# Altium schematic sheet Measuring.SchDoc: Measuring
size A4; ApprovedBy: Ekrem Turan Fırat; CheckedBy: Ekrem Turan Fırat; Author: Ekrem Turan Fırat; CompanyName: Mergen Elektronik; DrawnBy: Ekrem T. Fırat; Engineer: Ekrem Turan Fırat; Organization: Mergen Elektronik; Address1: Türkiye; DocumentNumber: 20240101; Revision: v0.0.1; SheetNumber: 6; SheetTotal: 7
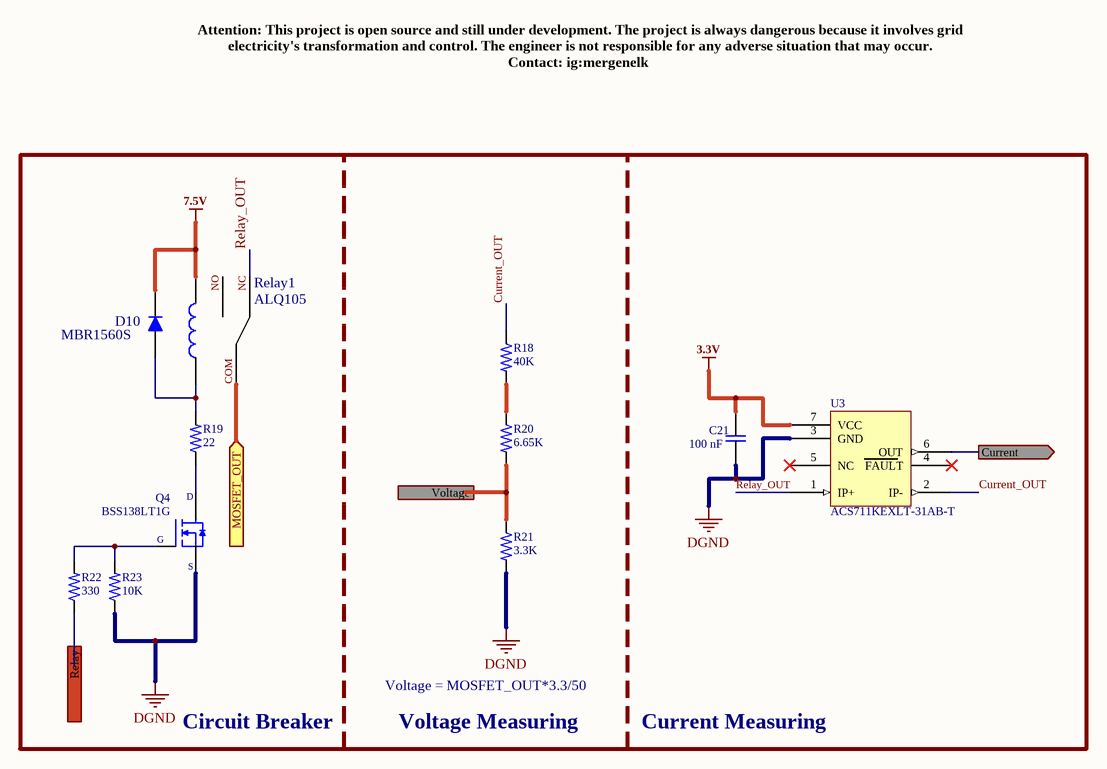
[diagram p0: Measuring.SchDoc]

## Parts
C21  100 nF  [MergenElektronik_Capacitors_Ceramics_SMDs_0603_S_NS]
D10  MBR1560S  [MergenElektronik_Diodes_SingleDiodes_TO-277B]
Q4  BSS138LT1G  [MergenElektronik_Transistors_Mosfets_SOT-23]
R18  40K  [MergenElektronik_Resistors_ChipResistors_0603_S_NS]
R19  22  [MergenElektronik_Resistors_ChipResistors_0603_S]
R20  6.65K  [MergenElektronik_Resistors_ChipResistors_0603_S_NS]
R21  3.3K  [MergenElektronik_Resistors_ChipResistors_0603_S_NS]
R22  330  [MergenElektronik_Resistors_ChipResistors_0603_S_NS]
R23  10K  [MergenElektronik_Resistors_ChipResistors_0603_S_NS]
Relay1  ALQ105  [MergenElektronik_Relays_PowerRelays_ALQ105]
U3  ACS711KEXLT-31AB-T  [MergenElektronik_Sensors_CurrentSensors_ACS711KEXLT-31AB-T]

## Ports
Current (out, see MicroController[3B]), MOSFET_OUT (in, see GateDriverandMosfets[3A], GateDriverandMosfets[3B], GateDriverandMosfets[3C]), Relay (in, see MicroController[3B]), Voltage (out, see MicroController[3B])

## Nets
3.3V: C21.1 U3.7(VCC)
7.5V: D10.2(KATOT) Relay1.C2
DGND: C21.2 Q4.2(Source) R21.2 R23.1 U3.3(GND)
Current: U3.6(OUT) ; port Current
Current_OUT: R18.1 U3.2(IP-)
MOSFET_OUT: Relay1.COM ; port MOSFET_OUT
Relay: R22.1 ; port Relay
Relay_OUT: Relay1.NC U3.1(IP+)
Voltage: R20.2 R21.1 ; port Voltage
NetD10_1: D10.1(ANOT) R19.2 Relay1.C1
NetQ4_1: Q4.1(Gate) R22.2 R23.2
NetQ4_3: Q4.3(Drain) R19.1
NetR18_2: R18.2 R20.1

Not connected (* = marked no-connect by the designer): Relay1 NO; U3 4(FAULT)* 5(NC)*

## Notes on the sheet
- Attention: This project is open source and still under development. The project is always dangerous because it involves grid electricity's transformation and control. The engineer is not responsible for any adverse situation that may occur.
  Contact: ig:mergenelk
- Circuit Breaker
- Voltage = MOSFET_OUT*3.3/50
- Voltage Measuring
- Current Measuring
- Title:
- Size:
- Date:
- A4
- Number:
- Time:
- Revision:
- Sheet
- of
- Project
- Drawn By :
- (in symbol MergenElektronik_Transistors_Mosfets_BSS138LT1G) D; G; S

## Library data of the parts
C21 = MergenElektronik_Capacitors_Ceramic_SMDs_100nF_16V: Mergen Elektronik - Capacitors - Ceramics - SMDs - 0603 - 100 nF - 16V; Manufacturer: Samsung; Manufacturer Number: CL10B104KO8NNNC; Model: Ceramic Capacitors; Tolerance: ±10%; Value: 100 nF; Temperature: -55°C up to +125°C; Digi-Key Number: 1276-1005-1-ND; Package: 0603(1608); Mouser Number: 187-CL10B104KO8NNNC; Mounting Type: Surface Mount; Farnell Number: 3013413; Supplier 1: Mouser; Supplier 2: Digi-Key; Supplier Part Number 1: 187-CL10B104KO8NNNC; Supplier Part Number 2: 1276-1005-6-ND; Özdisan Number: CL10B104KO8NNNC; Voltage Rated: 16V
D10 = MergenElektronik_Diodes_SingleDiodes_MBR1560S: Mergen Elektronik - Diodes - Single Diodes - MBR1560S; Manufacturer: SMC Diode Solutions; Voltage Rated: 60V; Current Rating: 15A; Digi-Key Number: 1655-MBR1560SCT-ND; Manufacturer Number: MBR1560S; Model: Single Diodes; Mounting Type: Surface Mount; Package: TO-277B; Temperature: -55°C up to +150°C; Supplier 1: Digi-Key; Supplier Part Number 1: 1655-MBR1560SCT-ND
Q4 = MergenElektronik_Transistors_Mosfets_BSS138LT1G: Mergen Elektronik - Transistors - Mosfets - BSS138LT1G; Manufacturer: onsemi; Voltage Rated: 50V; Model: Mosfet; Id: 200mA; Value: BSS138LT1G; Temperature: -55°C up to +175°C (TJ); Digi-Key Number: BSS138LT1GOSCT-ND; Manufacturer Number: BSS138LT1G; Package: SOT-23; Mounting Type: Surface Mount; Vdss: 50V; Rating Current: 200mA; Mouser Number: 863-BSS138LT1G; Farnell Number: 1431319; Supplier 1: Digi-Key; Supplier 2: Mouser; Supplier Part Number 1: BSS138LT1GOSCT-ND; Supplier Part Number 2: 863-BSS138LT1G; Özdisan Number: BSS138LT1G; Current Rating: 200mA
R18 = MergenElektronik_Resistors_ChipResistors_0603_40K: Mergen Elektronik - Resistors - Chip Resistors - 0603 - 40K; Manufacturer: YAGEO; Manufacturer Number: RT0603BRD0740KL; Value: Chip Resistor - 0603 - 40K; Power: 1/10W; Tolerance: ±0.1%; Package: 0603(1608); Temperature: -55°C up to +155°C - X8R; Model: Chip Resistor; Digi-Key Number: 13-RT0603BRD0740KLTR-ND; Mounting Type: Surface Mount; Mouser Number: 603-RT0603BRD0740KL; Supplier 1: Digikey; Supplier 2: Mouser; Supplier Part Number 1: 13-RT0603BRD0740KLDKR-ND; Supplier Part Number 2: 603-RT0603BRD0740KL
R19 = MergenElektronik_Resistors_ChipResistors_0603_22: Mergen Elektronik - Resistors - Chip Resistors - 0603 - 22; Manufacturer: TE Connectivity; Manufacturer Number: CRGCQ0603J22R; Value: Chip Resistor - 0603 - 22; Power: 1/10W; Tolerance: ±5%; Özdisan Number: RMCF0603ZT0R00; Package: 0603(1608); Temperature: -55°C up to +155°C - X8R; Model: Chip Resistor; Digi-Key Number: A130081CT-ND; Mounting Type: Surface Mount; Mouser Number: 279-CRGCQ0603J22R; Farnell Number: 2861854; Supplier 1: Digi-Key; Supplier 2: Mouser; Supplier Part Number 1: A130081CT-ND; Supplier Part Number 2: 279-CRGCQ0603J22R
R20 = MergenElektronik_Resistors_ChipResistors_0603_6.65K: Mergen Elektronik - Resistors - Chip Resistors - 0603 - 6.65K; Manufacturer: YAGEO; Manufacturer Number: RC0603FR-076K65L; Value: Chip Resistor - 0603 - 6.65K; Power: 1/10W; Tolerance: ±1%; Package: 0603(1608); Temperature: -55°C up to +155°C - X8R; Model: Chip Resistor; Digi-Key Number: 311-6.65KHRCT-ND; Mounting Type: Surface Mount; Mouser Number: 603-RC0603FR-076K65L; Farnell Number: 3950957; Özdisan Number: RC0603FR-076K65L; Supplier 1: Digikey; Supplier 2: Mouser; Supplier Part Number 1: 311-6.65KHRCT-ND; Supplier Part Number 2: 603-RC0603FR-076K65L
R21 = MergenElektronik_Resistors_ChipResistors_0603_3.3K: Mergen Elektronik - Resistors - Chip Resistors - 0603 - 3.3K; Manufacturer: YAGEO; Manufacturer Number: RC0603FR-073K3L; Value: Chip Resistor - 0603 - 3.3K; Power: 1/10W; Tolerance: ±1%; Package: 0603(1608); Temperature: -55°C up to +155°C - X8R; Model: Chip Resistor; Digi-Key Number: 311-3.30KHRTR-ND; Mounting Type: Surface Mount; Mouser Number: 603-RC0603FR-073K3L; Farnell Number: 9238549; Özdisan Number: RC0603FR-073K3L; Supplier 1: Digikey; Supplier 2: Mouser; Supplier Part Number 1: 311-3.30KHRCT-ND; Supplier Part Number 2: RC0603FR-073K3L
R22 = MergenElektronik_Resistors_ChipResistors_0603_330R: Mergen Elektronik - Resistors - Chip Resistors - 0603 - 330R; Manufacturer: Stackpole; Manufacturer Number: RMCF0603JT330R; Value: Chip Resistor - 0603 - 330R; Power: 1/10W; Tolerance: ±5%; Package: 0603(1608); Temperature: -55°C up to +155°C - X8R; Model: Chip Resistor; Digi-Key Number: RMCF0603JT330RCT-ND; Mounting Type: Surface Mount; Supplier 1: Digi-Key; Supplier Part Number 1: RMCF0603JT330RCT-ND
R23 = MergenElektronik_Resistors_ChipResistors_0603_10K: Mergen Elektronik - Resistors - Chip Resistors - 0603 - 10K; Manufacturer: Stackpole; Manufacturer Number: RMCF0603JT10K0; Value: Chip Resistor - 0603 - 10K; Power: 1/10W; Tolerance: ±5%; Package: 0603(1608); Temperature: -55°C up to +155°C - X8R; Model: Chip Resistor; Digi-Key Number: RMCF0603JT10K0CT-ND; Mounting Type: Surface Mount; Supplier 1: Digi-Key; Supplier Part Number 1: RMCF0603JT10K0-ND
Relay1 = MergenElektronik_Relays_PowerRelays_ALQ105: Mergen Elektronik - Relays - Power Relays - ALQ105; Manufacturer: Panasonic; Current Rating: 5A; Switching Voltage: 250VAC, 30VDC - Max; Digi-Key Number: 255-3565-ND; Manufacturer Number: ALQ105; Model: Power Relays; Mounting Type: THT; Value: ALQ105; Temperature: -40°C up to 85°C; Mouser Number: 769-ALQ105; Farnell Number: 2503675; Supplier 1: Digi-Key; Supplier Part Number 1: 255-3565-ND; Package: ALQ105; Supplier 2: Mouser; Supplier Part Number 2: 769-ALQ105
U3 = MergenElektronik_Sensors_CurrentSensors_ACS711KEXLT-31AB-T: Mergen Elektronik - Sensors - Current Sensors - ACS711KEXLT-31AB-T; Manufacturer: Allegro MicroSystems; Current Rating: 31A; Accuracy: ±5%; Operating Supply  Voltage: 3V up to 5.5V; Number of Channel: 1; Measuring: AC/DC; Sensor Type: Hall Effect; Digi-Key Number: 620-1482-1-ND; Manufacturer Number: ACS711KEXLT-31AB-T; Model: Current Sensor; Mounting Type: Surface Mount; Package: ACS711KEXLT-31AB-T; Mouser Number: 250-711KEXLT31ABT; Temperature: -40°C up to +125°C; Value: ACS711KEXLT-31AB-T; Özdisan Number: ACS711KEXLT-31AB-T; Farnell Number: 3594556; Supplier 1: Digi-Key; Supplier Part Number 1: 620-1482-1-ND; Supplier 2: Mouser; Supplier Part Number 2: 250-711KEXLT31ABT